# Altium project buck_reg_for_jetson.PrjPcb
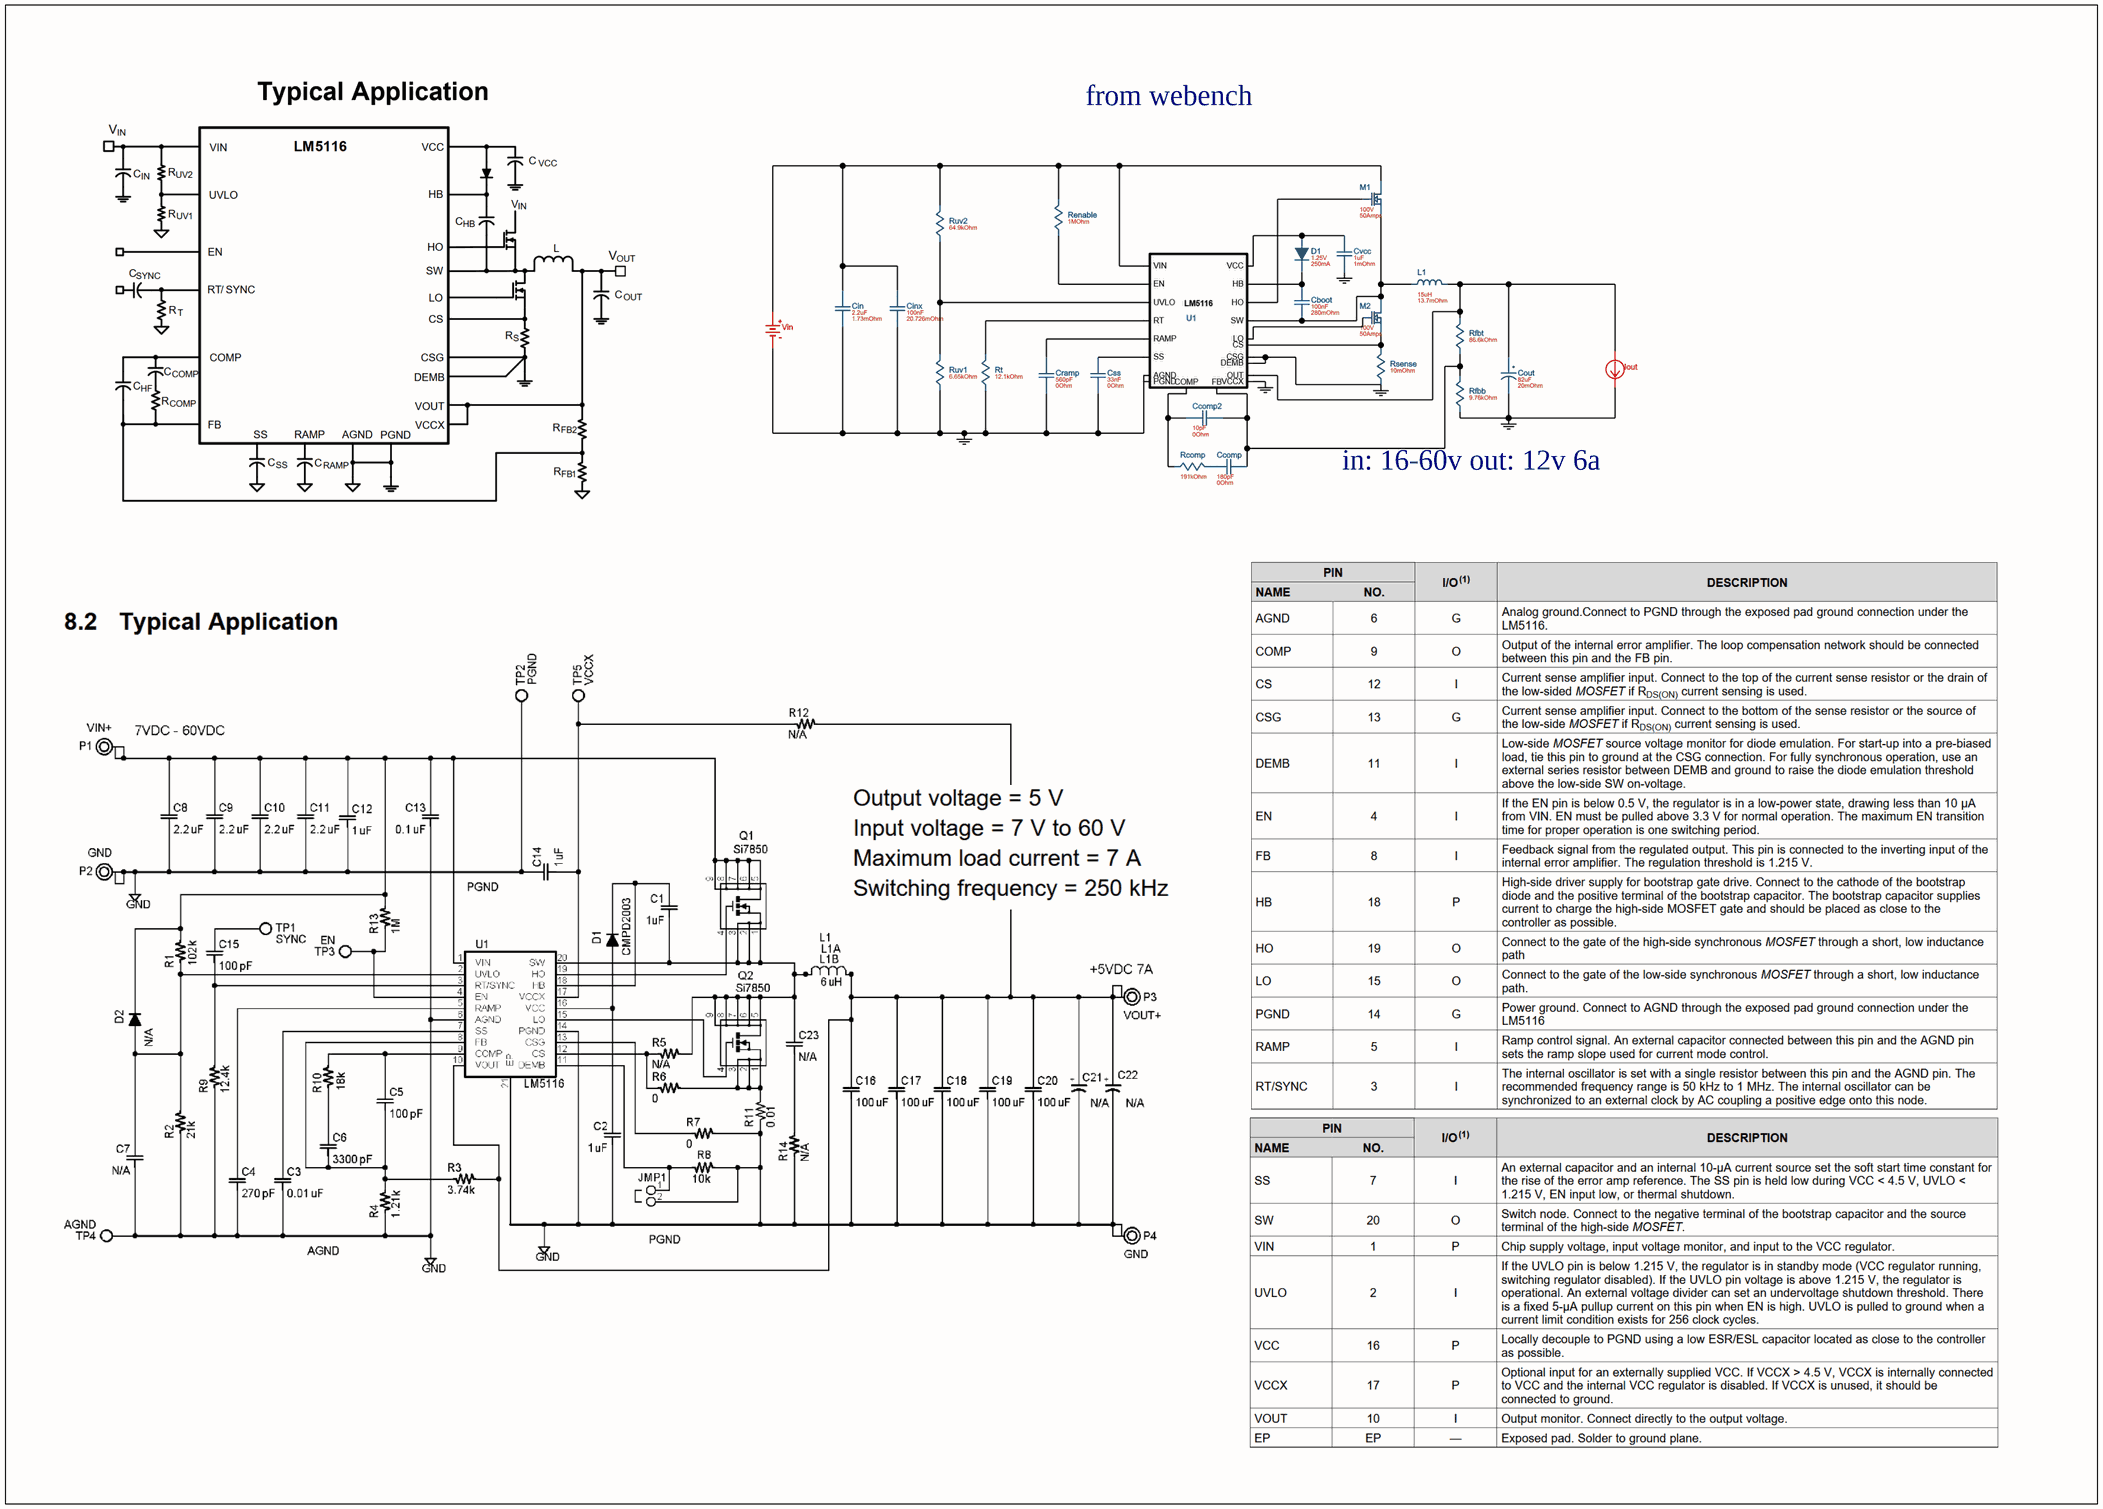
[diagram p0: reference.SchDoc]
3 sheets, 39 parts. Net scope: hierarchical (ports join the sheet entries above them; power ports are global).
Board file: PCB_main.PcbDoc
Sheets:
  reference.SchDoc
  main.SchDoc
    Designator = buck_reg_12v_6a.SchDoc

## Sheet reference.SchDoc
size A3; SheetNumber: 3; SheetTotal: 3

### Notes on the sheet
- from webench
- in: 16-60v out: 12v 6a

## Sheet main.SchDoc
size 149 x 100 mm; SheetNumber: 3; SheetTotal: 5
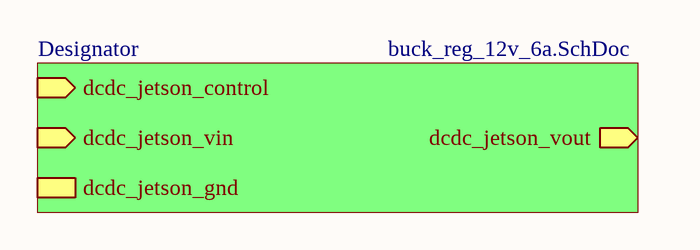
[diagram p1: main.SchDoc]

### Sub-sheets
Designator = buck_reg_12v_6a.SchDoc: dcdc_jetson_control (in), dcdc_jetson_vin (in), dcdc_jetson_gnd, dcdc_jetson_vout (out)

## Sheet buck_reg_12v_6a.SchDoc
size A3; SheetNumber: 3; SheetTotal: 3
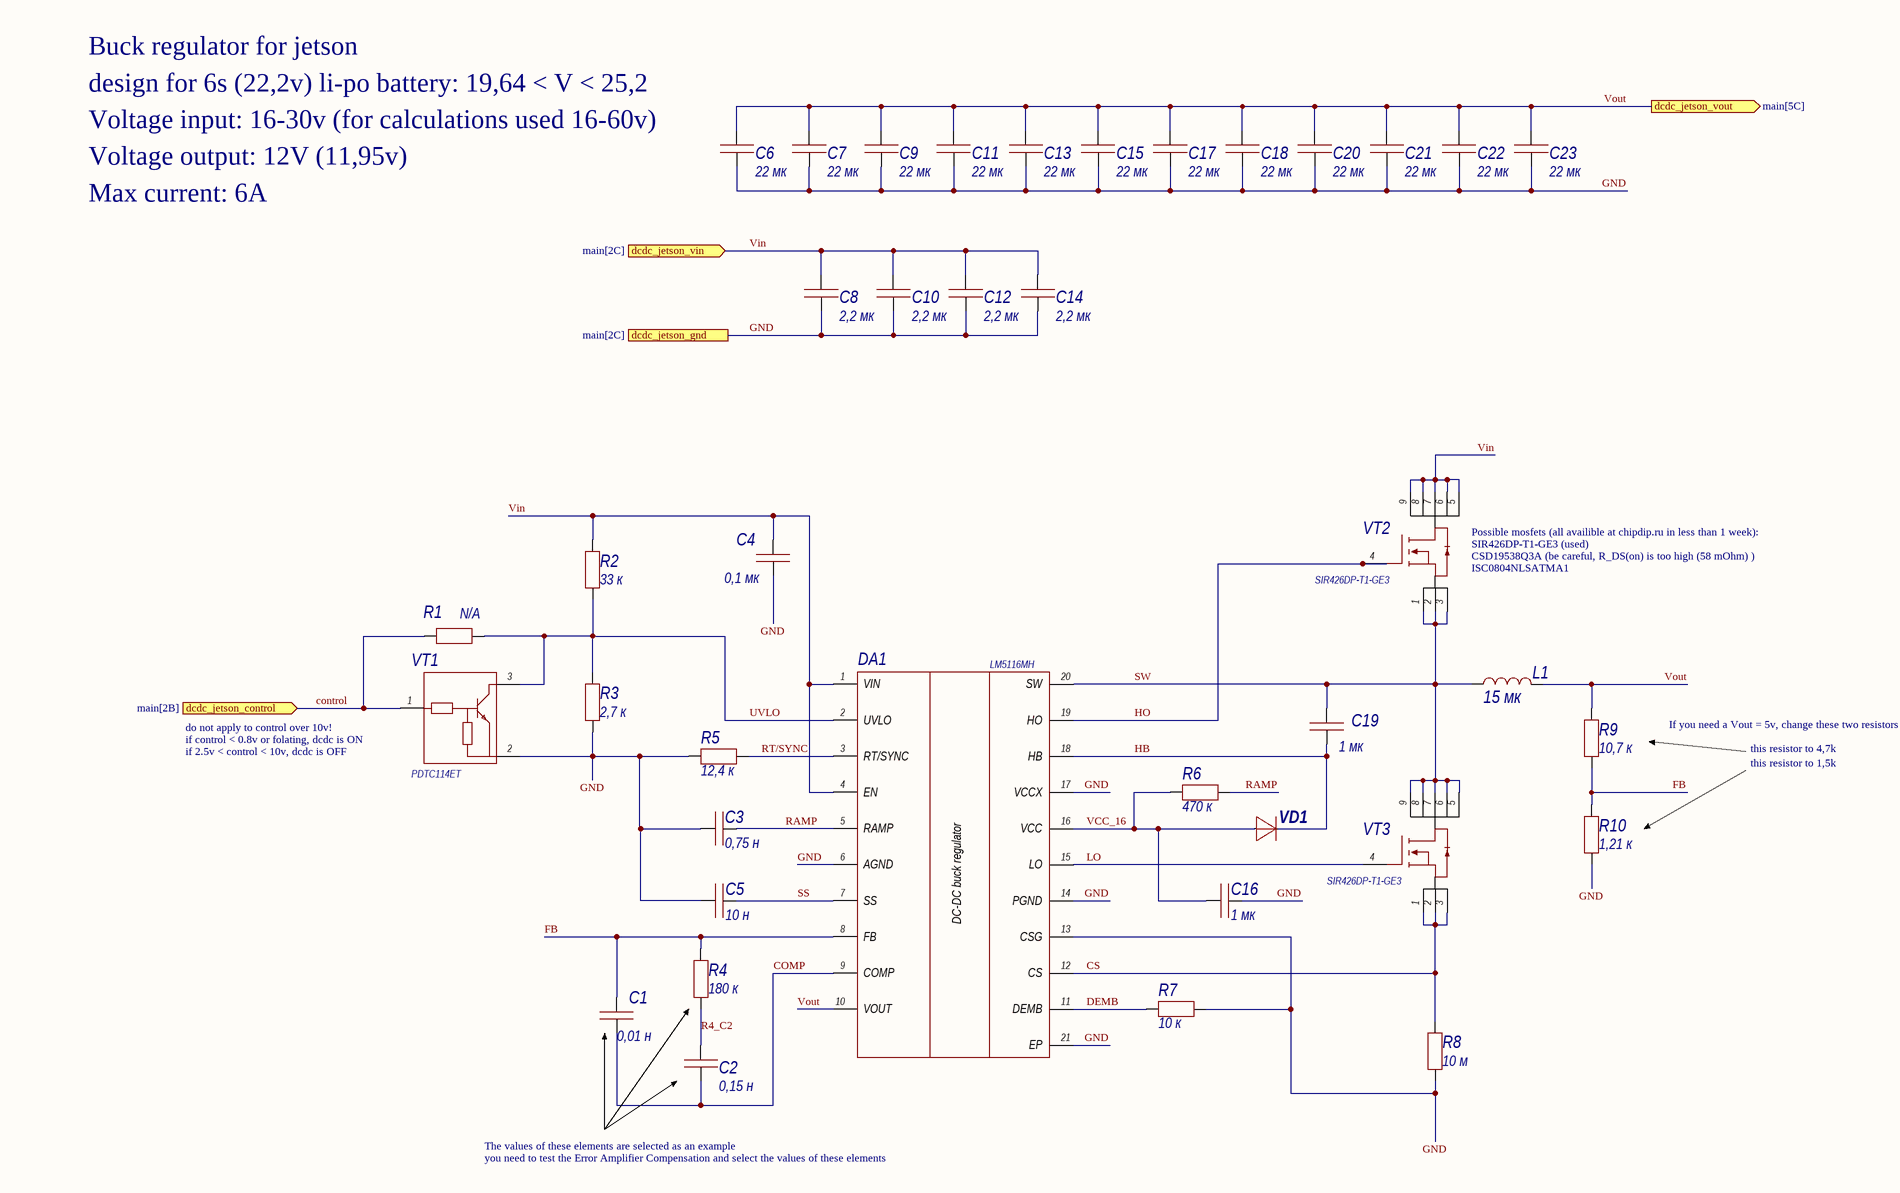
[diagram p2: buck_reg_12v_6a.SchDoc, top left]
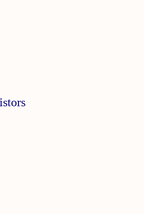
[diagram p3: buck_reg_12v_6a.SchDoc, top right]
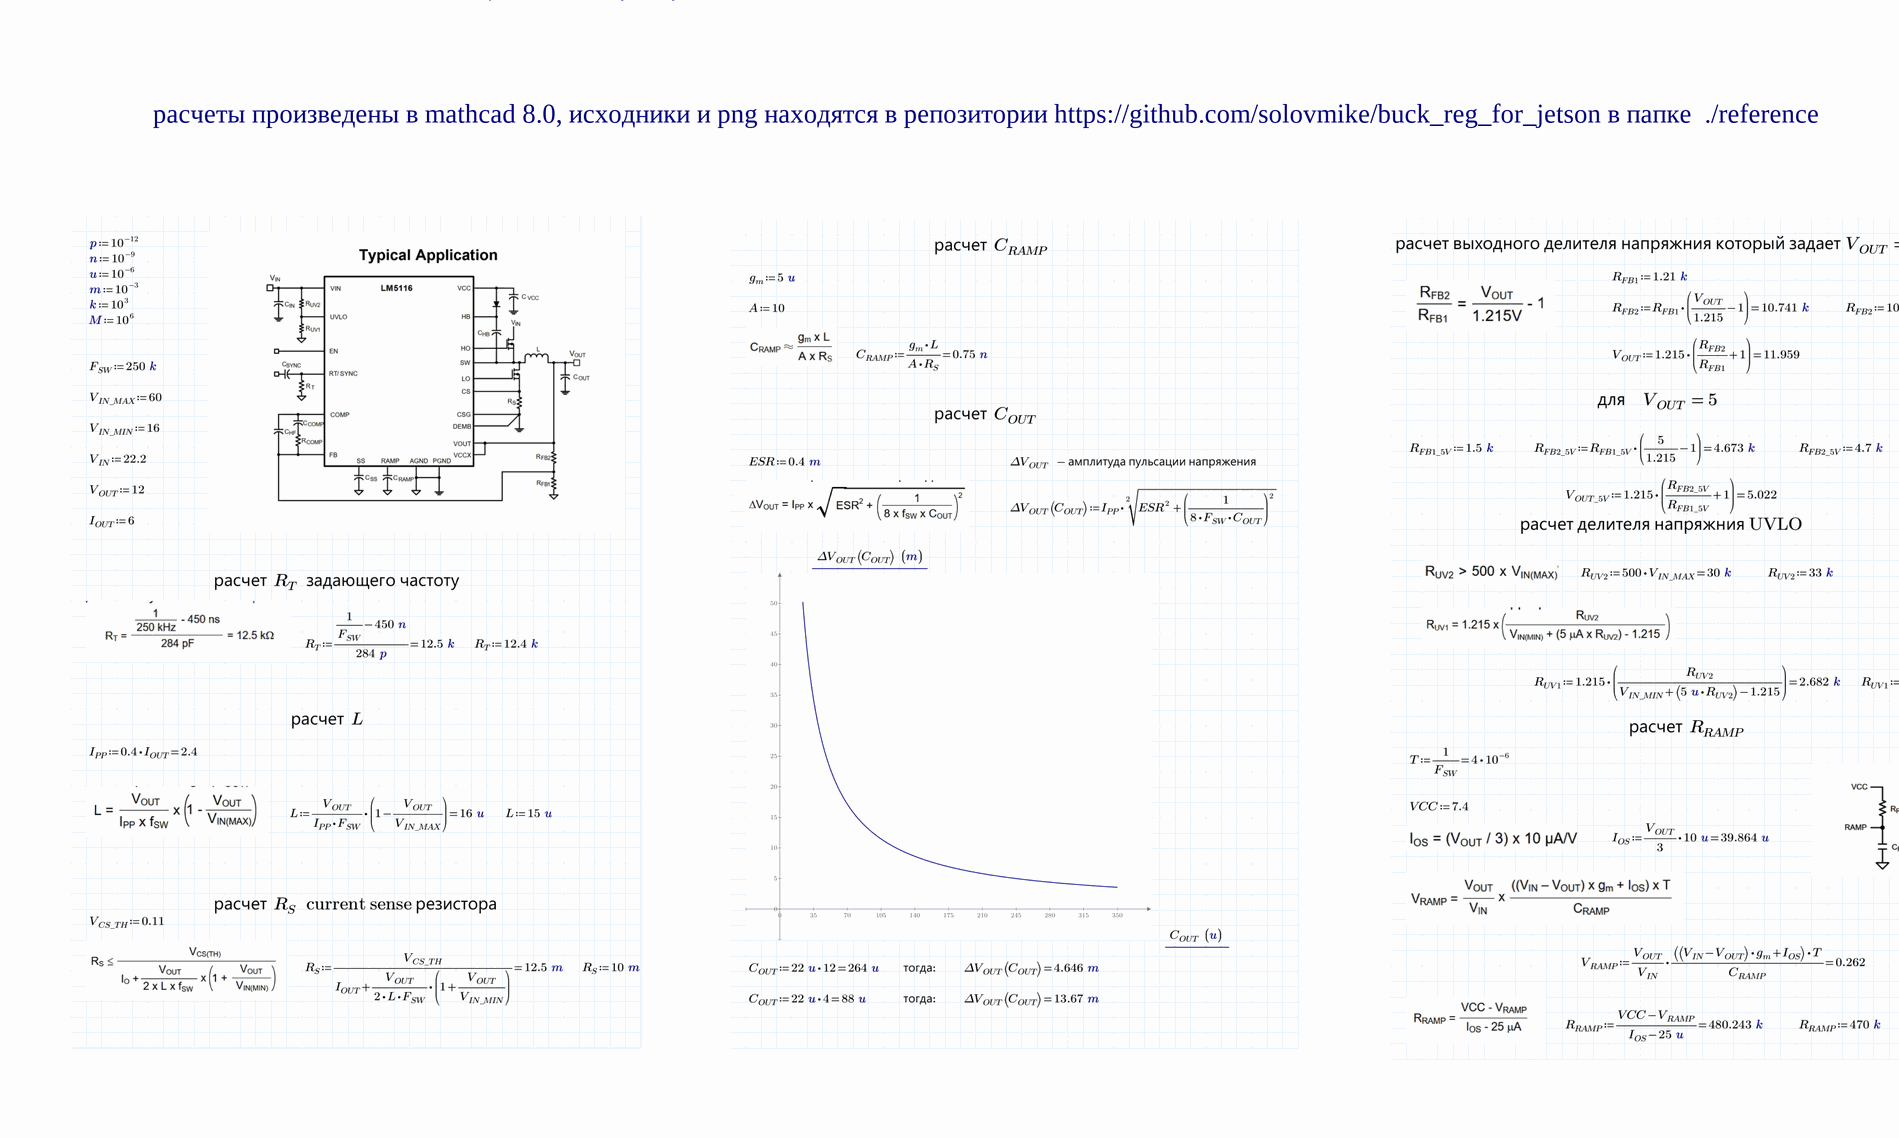
[diagram p4: buck_reg_12v_6a.SchDoc, bottom left]
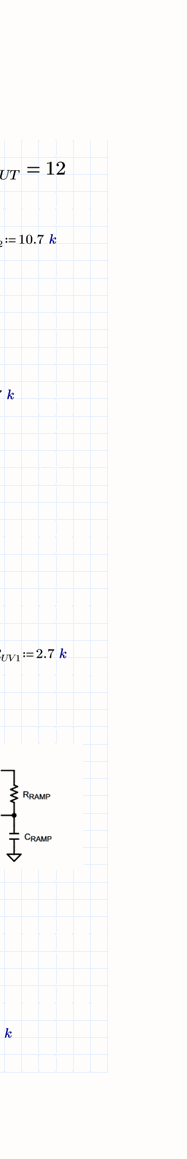
[diagram p5: buck_reg_12v_6a.SchDoc, bottom right]

### Parts
C1  value 0,01 н  [0603C]  (hidden comment: Capacitor)
C2  value 0,15 н  [0603C]  (hidden comment: Capacitor)
C3  value 0,75 н  [0603C]  (hidden comment: Capacitor)
C4  value 0,1 мк  [0603C]  (hidden comment: Capacitor)
C5  value 10 н  [0603C]  (hidden comment: Capacitor)
C6  value 22 мк  [1210C]  (hidden comment: Capacitor)
C7  value 22 мк  [1210C]  (hidden comment: Capacitor)
C8  value 2,2 мк  [1206C]  (hidden comment: Capacitor)
C9  value 22 мк  [1210C]  (hidden comment: Capacitor)
C10  value 2,2 мк  [1206C]  (hidden comment: Capacitor)
C11  value 22 мк  [1210C]  (hidden comment: Capacitor)
C12  value 2,2 мк  [1206C]  (hidden comment: Capacitor)
C13  value 22 мк  [1210C]  (hidden comment: Capacitor)
C14  value 2,2 мк  [1206C]  (hidden comment: Capacitor)
C15  value 22 мк  [1210C]  (hidden comment: Capacitor)
C16  value 1 мк  [0603C]  (hidden comment: Capacitor)
C17  value 22 мк  [1210C]  (hidden comment: Capacitor)
C18  value 22 мк  [1210C]  (hidden comment: Capacitor)
C19  value 1 мк  [0603C]  (hidden comment: Capacitor)
C20  value 22 мк  [1210C]  (hidden comment: Capacitor)
C21  value 22 мк  [1210C]  (hidden comment: Capacitor)
C22  value 22 мк  [1210C]  (hidden comment: Capacitor)
C23  value 22 мк  [1210C]  (hidden comment: Capacitor)
DA1  LM5116MH  [HTSSOP-20]
L1  value 15 мк  [SPRH127]  (hidden comment: CDSPRH127-150M)
R1  Resistor  [0603R]  (value not drawn)
R2  value 33 к  [0603R]  (hidden comment: Resistor)
R3  value 2,7 к  [0603R]  (hidden comment: Resistor)
R4  value 180 к  [0603R]  (hidden comment: Resistor)
R5  value 12,4 к  [0603R]  (hidden comment: Resistor)
R6  value 470 к  [0603R]  (hidden comment: Resistor)
R7  value 10 к  [0603R]  (hidden comment: Resistor)
R8  value 10 м  [1210R]  (hidden comment: Resistor)
R9  value 10,7 к  [0603R]  (hidden comment: Resistor)
R10  value 1,21 к  [0603R]  (hidden comment: Resistor)
VD1  ES1D-E3/61T  [SMA]  (value not drawn)
VT1  PDTC114ET  [SOT23-3]
VT2  SIR426DP-T1-GE3  [PowerPAK_SO-8]
VT3  SIR426DP-T1-GE3  [PowerPAK_SO-8]

### Ports
dcdc_jetson_control (in, see main[2B]), dcdc_jetson_gnd (see main[2C]), dcdc_jetson_vin (in, see main[2C]), dcdc_jetson_vout (out, see main[5C])

### Nets
COMP: C1.1 C2.1 DA1.9(COMP)
control: R1.1 VT1.1(B) ; port dcdc_jetson_control
CS: DA1.12(CS) R8.2 VT3.1 VT3.2 VT3.3
DEMB: DA1.11(DEMB) R7.1
FB: C1.2 DA1.8(FB) R4.2 R9.1 R10.2
GND: C3.1 C4.1 C5.1 C6.1 C7.1 C8.1 C9.1 C10.1 C11.1 C12.1 C13.1 C14.1 C15.1 C16.2 C17.1 C18.1 C20.1 C21.1 C22.1 C23.1 DA1.6(AGND) DA1.13(CSG) DA1.14(PGND) DA1.17(VCCX) DA1.21(EP) R3.1 R5.1 R7.2 R8.1 R10.1 VT1.2(E) ; port dcdc_jetson_gnd
HB: C19.1 DA1.18(HB) VD1.2
HO: DA1.19(HO) VT2.4
LO: DA1.15(LO) VT3.4
R4_C2: C2.2 R4.1
RAMP: C3.2 DA1.5(RAMP) R6.2
RT/SYNC: DA1.3(RT/SYNC) R5.2
SS: C5.2 DA1.7(SS)
SW: C19.2 DA1.20(SW) L1.1 VT2.1 VT2.2 VT2.3 VT3.5 VT3.6 VT3.7 VT3.8 VT3.9
UVLO: DA1.2(UVLO) R1.2 R2.1 R3.2 VT1.3(C)
VCC_16: C16.1 DA1.16(VCC) R6.1 VD1.1
Vin: C4.2 C8.2 C10.2 C12.2 C14.2 DA1.1(VIN) DA1.4(EN) R2.2 VT2.5 VT2.6 VT2.7 VT2.8 VT2.9 ; port dcdc_jetson_vin
Vout: C6.2 C7.2 C9.2 C11.2 C13.2 C15.2 C17.2 C18.2 C20.2 C21.2 C22.2 C23.2 DA1.10(VOUT) L1.2 R9.2 ; port dcdc_jetson_vout

### Notes on the sheet
- Buck regulator for jetson
- design for 6s (22,2v) li-po battery: 19,64 < V < 25,2
- (near C6) Voltage input: 16-30v (for calculations used 16-60v)
- Voltage output: 12V (11,95v)
- Max current: 6A
- (near VT2) Possible mosfets (all availible at chipdip.ru in less than 1 week):
- (near VT2) CSD19538Q3A (be careful, R_DS(on) is too high (58 mOhm) )
- (near VT2) SIR426DP-T1-GE3 (used)
- (near VT2) ISC0804NLSATMA1
- (near VT1) if control < 0.8v or folating, dcdc is ON
- do not apply to control over 10v!
- If you need a Vout = 5v, change these two resistors
- (near VT1) if 2.5v < control < 10v, dcdc is OFF
- this resistor to 4,7k
- this resistor to 1,5k
- The values of these elements are selected as an example
- you need to test the Error Amplifier Compensation and select the values of these elements
- расчеты произведены в mathcad 8.0, исходники и png находятся в репозитории https://github.com/solovmike/buck_reg_for_jetson в папке  ./reference
- (in symbol LM5116MH) DC-DC buck regulator

### Library data of the parts
C1 = Capacitor_0,01n_10_50V_X7R_0603C: Конденсатор; Library Path2: Schematic\Capacitor.SchLib; Tolerance: 0,1; Voltage (V): 50; Dielectric: X7R; Capacity (nF): 0,01; Part Number: Capacitor_0,01n_10_50V_X7R_0603C
C2 = Capacitor_0,15n_10_50V_X7R_0603C: Конденсатор; Library Path2: Schematic\Capacitor.SchLib; Tolerance: 0,1; Voltage (V): 50; Dielectric: X7R; Capacity (nF): 0,15; Part Number: Capacitor_0,15n_10_50V_X7R_0603C
C3 = Capacitor_0,75n_10_50V_X7R_0603C: Конденсатор; Library Path2: Schematic\Capacitor.SchLib; Tolerance: 0,1; Voltage (V): 50; Dielectric: X7R; Capacity (nF): 0,75; Part Number: Capacitor_0,75n_10_50V_X7R_0603C
C4 = Capacitor_0,1u_10_50V_X7R_0603C: Конденсатор; Library Path2: Schematic\Capacitor.SchLib; Tolerance: 0,1; Voltage (V): 50; Dielectric: X7R; Capacity (nF): 100; Part Number: Capacitor_0,1u_10_50V_X7R_0603C
C5 = Capacitor_10n_10_50V_X7R_0603C: Конденсатор; Library Path2: Schematic\Capacitor.SchLib; Tolerance: 0,1; Voltage (V): 50; Dielectric: X7R; Capacity (nF): 10; Part Number: Capacitor_10n_10_50V_X7R_0603C
C6 C7 C9 C11 C13 C15 C17 C18 C20-C23 = Capacitor_22u_10_25V_X7R_1210C: Конденсатор; Library Path2: Schematic\Capacitor.SchLib; Tolerance: 0,1; Voltage (V): 25; Dielectric: X7R; Capacity (nF): 22000; Part Number: Capacitor_22u_10_25V_X7R_1210C
C8 C10 C12 C14 = Capacitor_2,2u_10_50V_X7R_1206C: Конденсатор; Library Path2: Schematic\Capacitor.SchLib; Tolerance: 0,1; Voltage (V): 50; Dielectric: X7R; Capacity (nF): 2200; Part Number: Capacitor_2,2u_10_50V_X7R_1206C
C16 C19 = Capacitor_1u_10_50V_X7R_0603C: Конденсатор; Library Path2: Schematic\Capacitor.SchLib; Tolerance: 0,1; Voltage (V): 50; Dielectric: X7R; Capacity (nF): 1000; Part Number: Capacitor_1u_10_50V_X7R_0603C
DA1 = LM5116MH: dc-dc понижающий adj 6-100v; Manufacturer_Part_Number: LM5116MH/NOPB; Part Number: LM5116MH
L1 = CDSPRH127-150M: Индуктивность на 15 мкГн, номинальный ток 8,4 А; Inductance (μH): 15; Current (A): 8,4; Part Number: CDSPRH127-150M
R1 = res_0603_N/A: посадочное место 0603 под перемычку; Tolerance: 1%; Power: *; Value: N/A; Part Number: res_0603_N/A
R2 = Resistor_33k_1_0603: Резистор номиналом 33 кОм и точностью 1%; Power: *; Part Number: Resistor_33k_1_0603; Tolerance: 1%
R3 = Resistor_2.7k_1_0603: Резистор номиналом 2,7 кОм и точностью 1%; Power: *; Part Number: Resistor_2.7k_1_0603; Tolerance: 1%
R4 = Resistor_180k_1_0603: Резистор номиналом 180 кОм и точностью 1%; Power: *; Part Number: Resistor_180k_1_0603; Tolerance: 1%
R5 = Resistor_12.4k_1_0603: Резистор номиналом 12,4 кОм и точностью 1%; Power: *; Part Number: Resistor_12.4k_1_0603; Tolerance: 1%
R6 = Resistor_470k_1_0603: Резистор номиналом 470 кОм и точностью 1%; Power: *; Part Number: Resistor_470k_1_0603; Tolerance: 1%
R7 = Resistor_10k_1_0603: Резистор номиналом 10 кОм и точностью 1%; Power: *; Part Number: Resistor_10k_1_0603; Tolerance: 1%
R8 = RL1210FR-070R01L: Резистор номиналом 10 мОм, точностью 1%, 0.5Вт; Power: *; Part Number: RL1210FR-070R01L; Tolerance: 1%
R9 = Resistor_10.7k_1_0603: Резистор номиналом 10,7 кОм и точностью 1%; Power: *; Part Number: Resistor_10.7k_1_0603; Tolerance: 1%
R10 = Resistor_1.21k_1_0603: Резистор номиналом 1,21 кОм и точностью 1%; Power: *; Part Number: Resistor_1.21k_1_0603; Tolerance: 1%
VD1 = ES1D-E3/61T: Диод 1A 200V; Repetitive peak reverse voltage (Vrrm): 200; Current (A): 1; Part Number: ES1D-E3/61T
VT1 = PDTC114ET: цифровой npn 50в 100мА; Ток макс#: 0, 1 А; Part Number: PDTC114ET; Напряжение С-И/К-Э: 50 В
VT2 VT3 = SIR426DP-T1-GE3: Транзистор полевой MOSFET N-канальный 40В 41.7Вт; Part Number: SIR426DP-T1-GE3; Напряжение С-И/К-Э: 40 В

## Assembly variants
5v_vout: alternate parts R9 -> Resistor_4.7k_1_0603, R10 -> Resistor_1.5k_1_0603